# Altium schematic sheet cpu2_lock_control1.SchDoc
size A3; DocumentNumber: 8; Revision: V1.0; SheetNumber: 8; SheetTotal: 9; Rule: PcbType=ProtelPcb
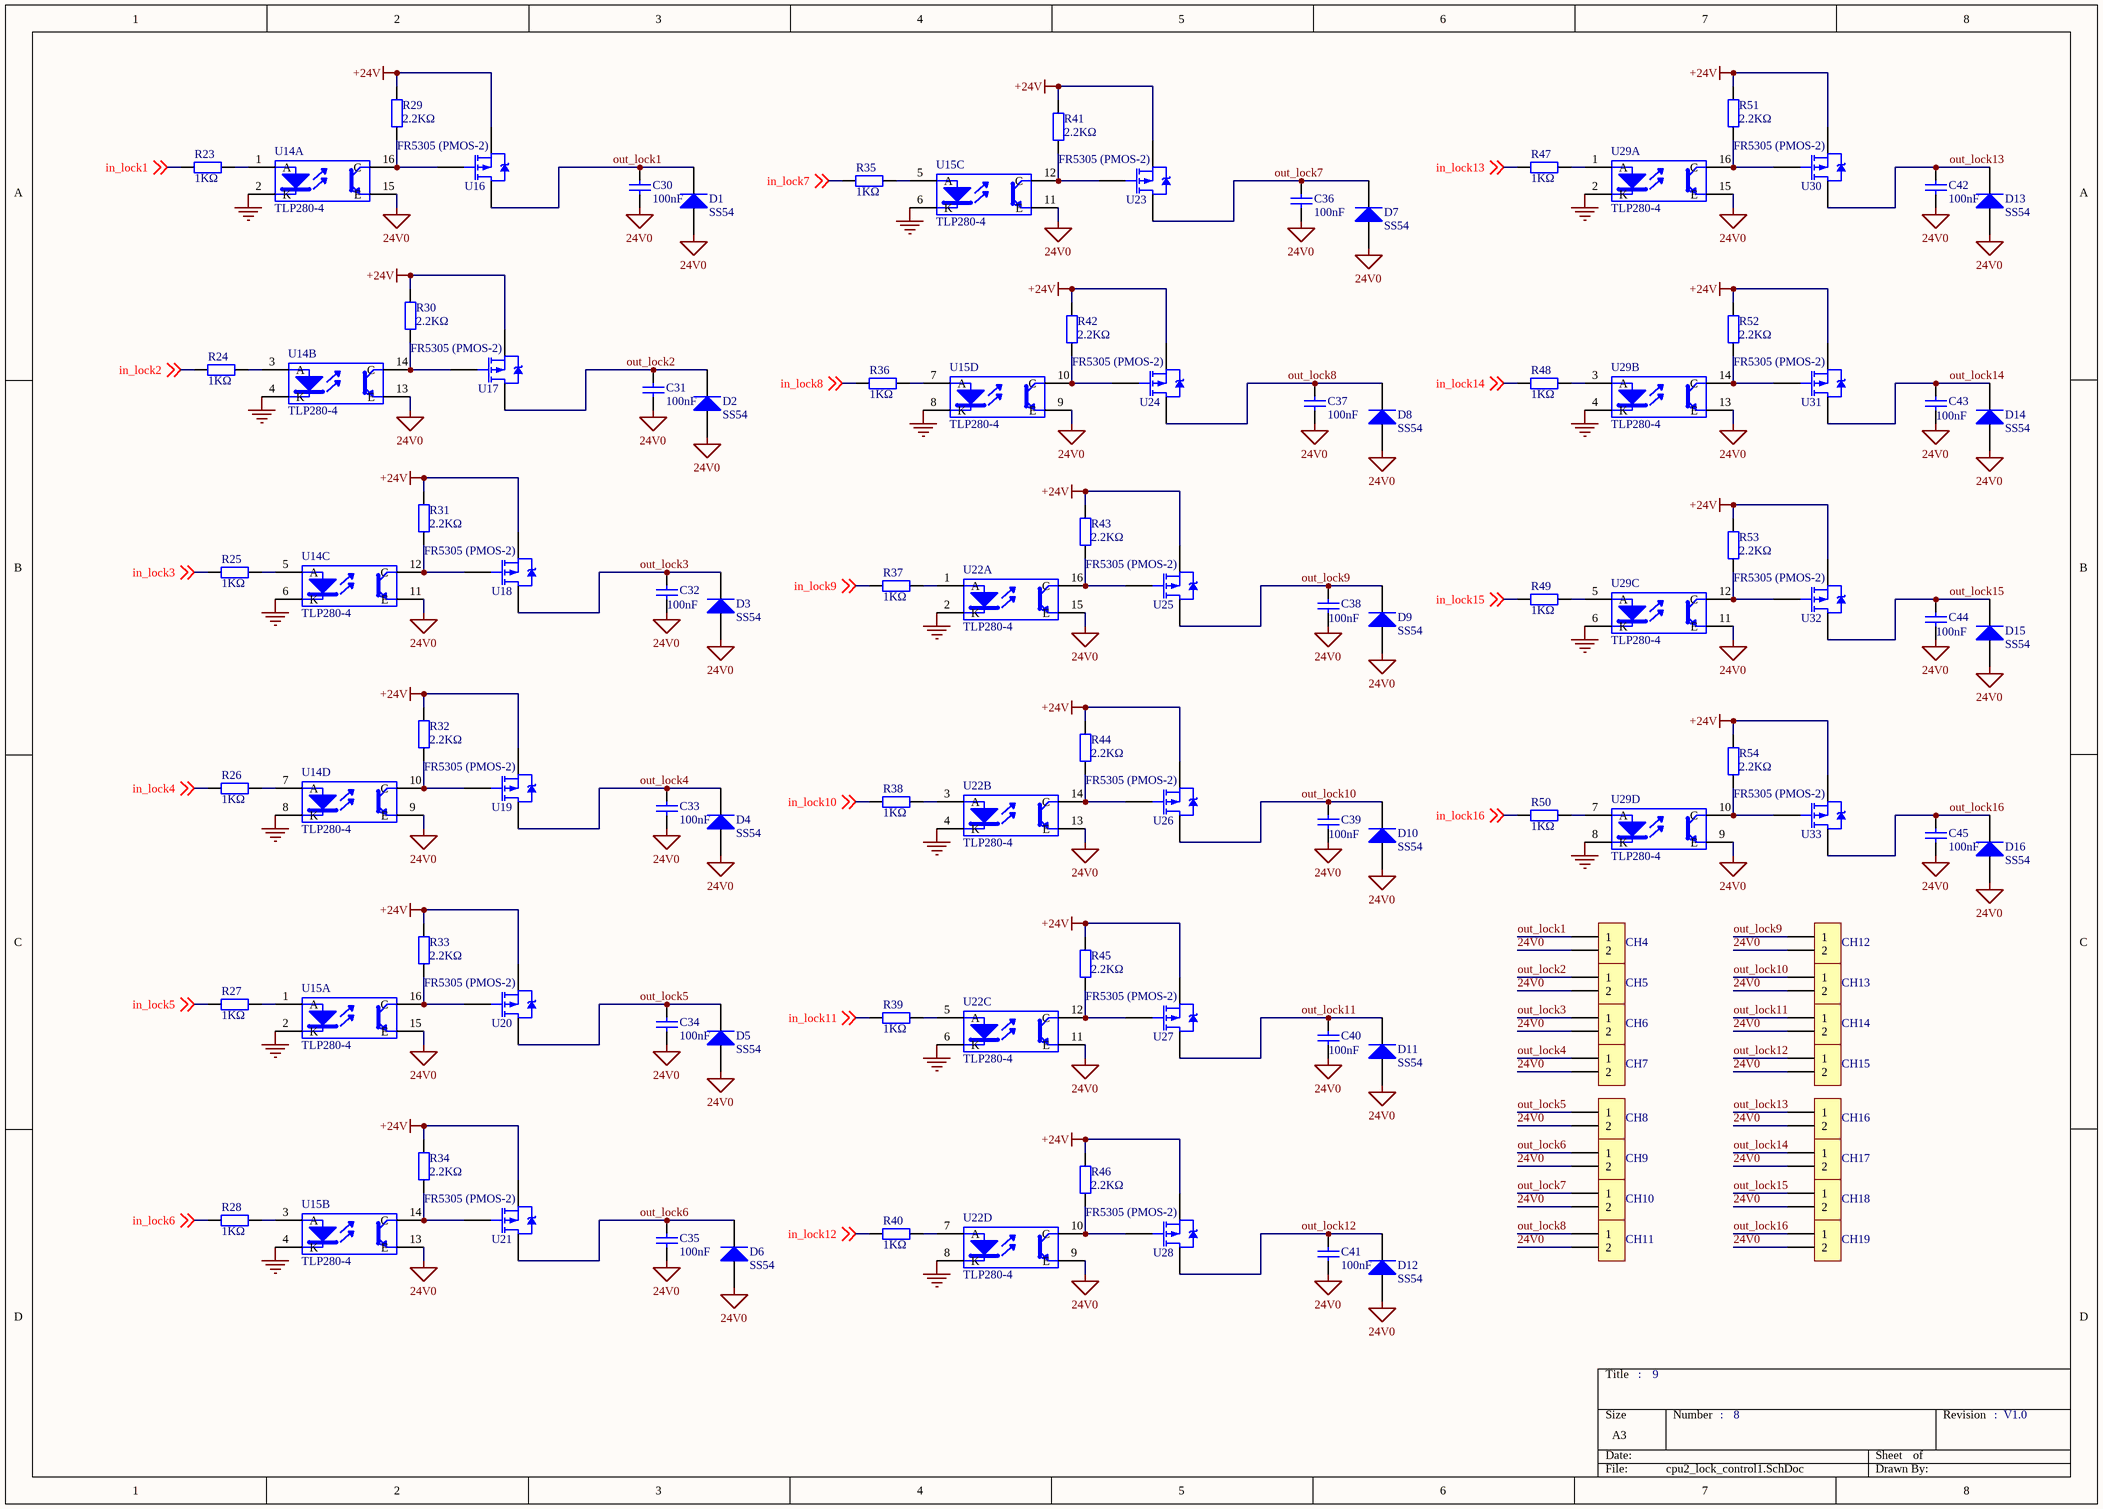
[diagram p0: cpu2_lock_control1.SchDoc]

## Parts
C30  100nF  [0805_C]
C31  100nF  [0805_C]
C32  100nF  [0805_C]
C33  100nF  [0805_C]
C34  100nF  [0805_C]
C35  100nF  [0805_C]
C36  100nF  [0805_C]
C37  100nF  [0805_C]
C38  100nF  [0805_C]
C39  100nF  [0805_C]
C40  100nF  [0805_C]
C41  100nF  [0805_C]
C42  100nF  [0805_C]
C43  100nF  [0805_C]
C44  100nF  [0805_C]
C45  100nF  [0805_C]
CH4  HEADER1X2  [CH3.96-2PIN]  (value not drawn)
CH5  HEADER1X2  [CH3.96-2PIN]  (value not drawn)
CH6  HEADER1X2  [CH3.96-2PIN]  (value not drawn)
CH7  HEADER1X2  [CH3.96-2PIN]  (value not drawn)
CH8  HEADER1X2  [CH3.96-2PIN]  (value not drawn)
CH9  HEADER1X2  [CH3.96-2PIN]  (value not drawn)
CH10  HEADER1X2  [CH3.96-2PIN]  (value not drawn)
CH11  HEADER1X2  [CH3.96-2PIN]  (value not drawn)
CH12  HEADER1X2  [CH3.96-2PIN]  (value not drawn)
CH13  HEADER1X2  [CH3.96-2PIN]  (value not drawn)
CH14  HEADER1X2  [CH3.96-2PIN]  (value not drawn)
CH15  HEADER1X2  [CH3.96-2PIN]  (value not drawn)
CH16  HEADER1X2  [CH3.96-2PIN]  (value not drawn)
CH17  HEADER1X2  [CH3.96-2PIN]  (value not drawn)
CH18  HEADER1X2  [CH3.96-2PIN]  (value not drawn)
CH19  HEADER1X2  [CH3.96-2PIN]  (value not drawn)
D1  SS54  [SMA(DO-214AC)_S1]
D2  SS54  [SMA(DO-214AC)_S1]
D3  SS54  [SMA(DO-214AC)_S1]
D4  SS54  [SMA(DO-214AC)_S1]
D5  SS54  [SMA(DO-214AC)_S1]
D6  SS54  [SMA(DO-214AC)_S1]
D7  SS54  [SMA(DO-214AC)_S1]
D8  SS54  [SMA(DO-214AC)_S1]
D9  SS54  [SMA(DO-214AC)_S1]
D10  SS54  [SMA(DO-214AC)_S1]
D11  SS54  [SMA(DO-214AC)_S1]
D12  SS54  [SMA(DO-214AC)_S1]
D13  SS54  [SMA(DO-214AC)_S1]
D14  SS54  [SMA(DO-214AC)_S1]
D15  SS54  [SMA(DO-214AC)_S1]
D16  SS54  [SMA(DO-214AC)_S1]
R23  1KΩ  [0805_R]
R24  1KΩ  [0805_R]
R25  1KΩ  [0805_R]
R26  1KΩ  [0805_R]
R27  1KΩ  [0805_R]
R28  1KΩ  [0805_R]
R29  2.2KΩ  [0805_R]
R30  2.2KΩ  [0805_R]
R31  2.2KΩ  [0805_R]
R32  2.2KΩ  [0805_R]
R33  2.2KΩ  [0805_R]
R34  2.2KΩ  [0805_R]
R35  1KΩ  [0805_R]
R36  1KΩ  [0805_R]
R37  1KΩ  [0805_R]
R38  1KΩ  [0805_R]
R39  1KΩ  [0805_R]
R40  1KΩ  [0805_R]
R41  2.2KΩ  [0805_R]
R42  2.2KΩ  [0805_R]
R43  2.2KΩ  [0805_R]
R44  2.2KΩ  [0805_R]
R45  2.2KΩ  [0805_R]
R46  2.2KΩ  [0805_R]
R47  1KΩ  [0805_R]
R48  1KΩ  [0805_R]
R49  1KΩ  [0805_R]
R50  1KΩ  [0805_R]
R51  2.2KΩ  [0805_R]
R52  2.2KΩ  [0805_R]
R53  2.2KΩ  [0805_R]
R54  2.2KΩ  [0805_R]
U14  TLP280-4  [SO16]  (parts A,B,C,D of 4)
U15  TLP280-4  [SO16]  (parts A,B,C,D of 4)
U16  FR5305 (PMOS-2)  [TO-252]
U17  FR5305 (PMOS-2)  [TO-252]
U18  FR5305 (PMOS-2)  [TO-252]
U19  FR5305 (PMOS-2)  [TO-252]
U20  FR5305 (PMOS-2)  [TO-252]
U21  FR5305 (PMOS-2)  [TO-252]
U22  TLP280-4  [SO16]  (parts A,B,C,D of 4)
U23  FR5305 (PMOS-2)  [TO-252]
U24  FR5305 (PMOS-2)  [TO-252]
U25  FR5305 (PMOS-2)  [TO-252]
U26  FR5305 (PMOS-2)  [TO-252]
U27  FR5305 (PMOS-2)  [TO-252]
U28  FR5305 (PMOS-2)  [TO-252]
U29  TLP280-4  [SO16]  (parts A,B,C,D of 4)
U30  FR5305 (PMOS-2)  [TO-252]
U31  FR5305 (PMOS-2)  [TO-252]
U32  FR5305 (PMOS-2)  [TO-252]
U33  FR5305 (PMOS-2)  [TO-252]

## Nets
24V0: C30.1 C31.1 C32.1 C33.1 C34.1 C35.1 C36.1 C37.1 C38.1 C39.1 C40.1 C41.1 C42.1 C43.1 C44.1 C45.1 CH4.2 CH5.2 CH6.2 CH7.2 CH8.2 CH9.2 CH10.2 CH11.2 CH12.2 CH13.2 CH14.2 CH15.2 CH16.2 CH17.2 CH18.2 CH19.2 D1.1(A) D2.1(A) D3.1(A) D4.1(A) D5.1(A) D6.1(A) D7.1(A) D8.1(A) D9.1(A) D10.1(A) D11.1(A) D12.1(A) D13.1(A) D14.1(A) D15.1(A) D16.1(A) U14.9(E) U14.11(E) U14.13(E) U14.15(E) U15.9(E) U15.11(E) U15.13(E) U15.15(E) U22.9(E) U22.11(E) U22.13(E) U22.15(E) U29.9(E) U29.11(E) U29.13(E) U29.15(E)
+24V: R29.2 R30.2 R31.2 R32.2 R33.2 R34.2 R41.2 R42.2 R43.2 R44.2 R45.2 R46.2 R51.2 R52.2 R53.2 R54.2 U16.3(S) U17.3(S) U18.3(S) U19.3(S) U20.3(S) U21.3(S) U23.3(S) U24.3(S) U25.3(S) U26.3(S) U27.3(S) U28.3(S) U30.3(S) U31.3(S) U32.3(S) U33.3(S)
GND: U14.2(K) U14.4(K) U14.6(K) U14.8(K) U15.2(K) U15.4(K) U15.6(K) U15.8(K) U22.2(K) U22.4(K) U22.6(K) U22.8(K) U29.2(K) U29.4(K) U29.6(K) U29.8(K)
in_lock1: R23.1 ; off-sheet in_lock1
in_lock2: R24.1 ; off-sheet in_lock2
in_lock3: R25.1 ; off-sheet in_lock3
in_lock4: R26.1 ; off-sheet in_lock4
in_lock5: R27.1 ; off-sheet in_lock5
in_lock6: R28.1 ; off-sheet in_lock6
in_lock7: R35.1 ; off-sheet in_lock7
in_lock8: R36.1 ; off-sheet in_lock8
in_lock9: R37.1 ; off-sheet in_lock9
in_lock10: R38.1 ; off-sheet in_lock10
in_lock11: R39.1 ; off-sheet in_lock11
in_lock12: R40.1 ; off-sheet in_lock12
in_lock13: R47.1 ; off-sheet in_lock13
in_lock14: R48.1 ; off-sheet in_lock14
in_lock15: R49.1 ; off-sheet in_lock15
in_lock16: R50.1 ; off-sheet in_lock16
out_lock1: C30.2 CH4.1 D1.2(K) U16.2(D)
out_lock2: C31.2 CH5.1 D2.2(K) U17.2(D)
out_lock3: C32.2 CH6.1 D3.2(K) U18.2(D)
out_lock4: C33.2 CH7.1 D4.2(K) U19.2(D)
out_lock5: C34.2 CH8.1 D5.2(K) U20.2(D)
out_lock6: C35.2 CH9.1 D6.2(K) U21.2(D)
out_lock7: C36.2 CH10.1 D7.2(K) U23.2(D)
out_lock8: C37.2 CH11.1 D8.2(K) U24.2(D)
out_lock9: C38.2 CH12.1 D9.2(K) U25.2(D)
out_lock10: C39.2 CH13.1 D10.2(K) U26.2(D)
out_lock11: C40.2 CH14.1 D11.2(K) U27.2(D)
out_lock12: C41.2 CH15.1 D12.2(K) U28.2(D)
out_lock13: C42.2 CH16.1 D13.2(K) U30.2(D)
out_lock14: C43.2 CH17.1 D14.2(K) U31.2(D)
out_lock15: C44.2 CH18.1 D15.2(K) U32.2(D)
out_lock16: C45.2 CH19.1 D16.2(K) U33.2(D)
NetR23_2: R23.2 U14.1(A)
NetR24_2: R24.2 U14.3(A)
NetR25_2: R25.2 U14.5(A)
NetR26_2: R26.2 U14.7(A)
NetR27_2: R27.2 U15.1(A)
NetR28_2: R28.2 U15.3(A)
NetR29_1: R29.1 U14.16(C) U16.1(G)
NetR30_1: R30.1 U14.14(C) U17.1(G)
NetR31_1: R31.1 U14.12(C) U18.1(G)
NetR32_1: R32.1 U14.10(C) U19.1(G)
NetR33_1: R33.1 U15.16(C) U20.1(G)
NetR34_1: R34.1 U15.14(C) U21.1(G)
NetR35_2: R35.2 U15.5(A)
NetR36_2: R36.2 U15.7(A)
NetR37_2: R37.2 U22.1(A)
NetR38_2: R38.2 U22.3(A)
NetR39_2: R39.2 U22.5(A)
NetR40_2: R40.2 U22.7(A)
NetR41_1: R41.1 U15.12(C) U23.1(G)
NetR42_1: R42.1 U15.10(C) U24.1(G)
NetR43_1: R43.1 U22.16(C) U25.1(G)
NetR44_1: R44.1 U22.14(C) U26.1(G)
NetR45_1: R45.1 U22.12(C) U27.1(G)
NetR46_1: R46.1 U22.10(C) U28.1(G)
NetR47_2: R47.2 U29.1(A)
NetR48_2: R48.2 U29.3(A)
NetR49_2: R49.2 U29.5(A)
NetR50_2: R50.2 U29.7(A)
NetR51_1: R51.1 U29.16(C) U30.1(G)
NetR52_1: R52.1 U29.14(C) U31.1(G)
NetR53_1: R53.1 U29.12(C) U32.1(G)
NetR54_1: R54.1 U29.10(C) U33.1(G)

## Notes on the sheet
- :

## Library data of the parts
C30-C45 = 0805 100nF(104) 10% 50V: 贴片电容; ComponentLink1Description: 供应商链接; ComponentLink1URL: http://www.szlcsc.com/product/details_50686.html; Package: 0805; Supplier: LC; SuppliersPartNumber: C49678
D1-D16 = SMA(DO-214AC) SS54: 二极管; ComponentLink1Description: 供应商链接; ComponentLink1URL: http://www.szlcsc.com/product/details_23178.html; Package: SMA(DO-214AC); Supplier: LC; SuppliersPartNumber: C22452
R23-R54 = 0805 11KΩ (1102) 1%: 贴片电阻; ComponentLink1Description: 供应商链接; ComponentLink1URL: http://www.szlcsc.com/product/details_18117.html; Package: 0805; Supplier: LC; SuppliersPartNumber: C17429
U14 U15 U22 U29 = TLP521-4
U16-U21 U23-U28 U30-U33 = PMOS-2: P-Channel Power MOSFET; Note: Pin 4 not drawn and electrically connected to Pin 2.; Published: 8-Jun-2000; LatestRevisionDate: 17-Jul-2002; LatestRevisionNote: Re-released for DXP Platform.; DatasheetDocument: PD-9.390D; PackageReference: TO-220AB; Publisher: Altium Limited; Code_JEDEC: TO-220-AB; ComponentLink1Description: Manufacturer Link; ComponentLink1URL: http://www.irf.com/